# EAGLE schematic A13-SOM-LTE_Rev_B1 (EAGLE 4.16)
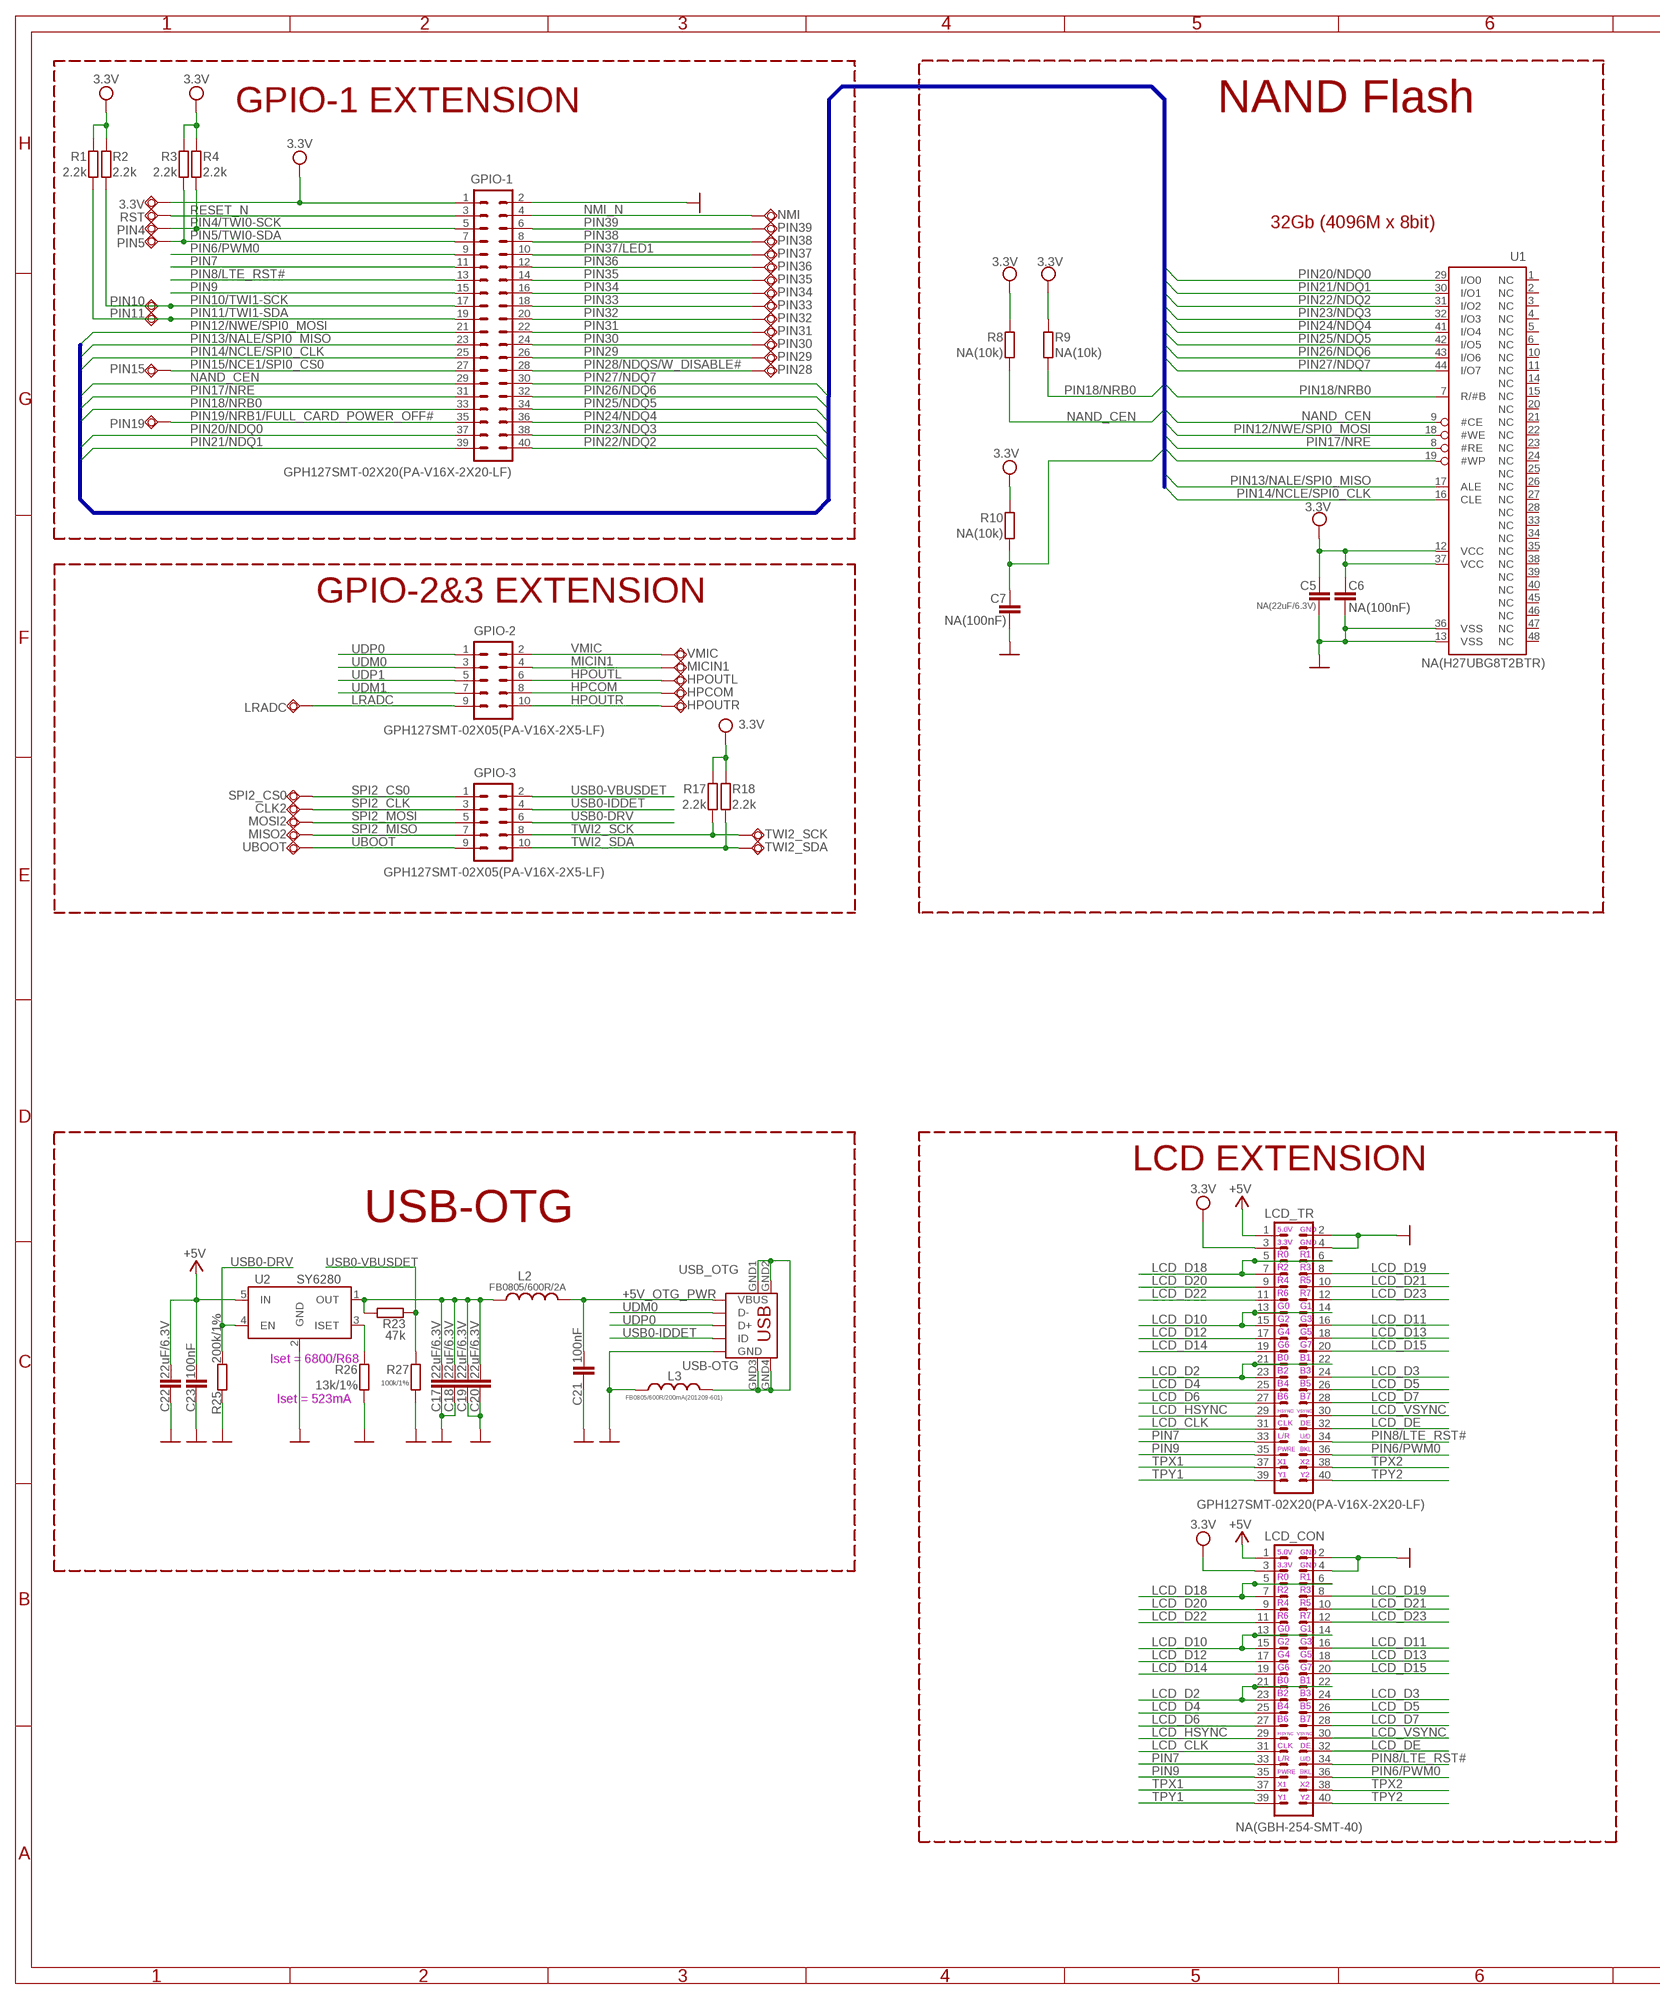
[diagram p0: schematic, sheet 1, part 1 of 2]
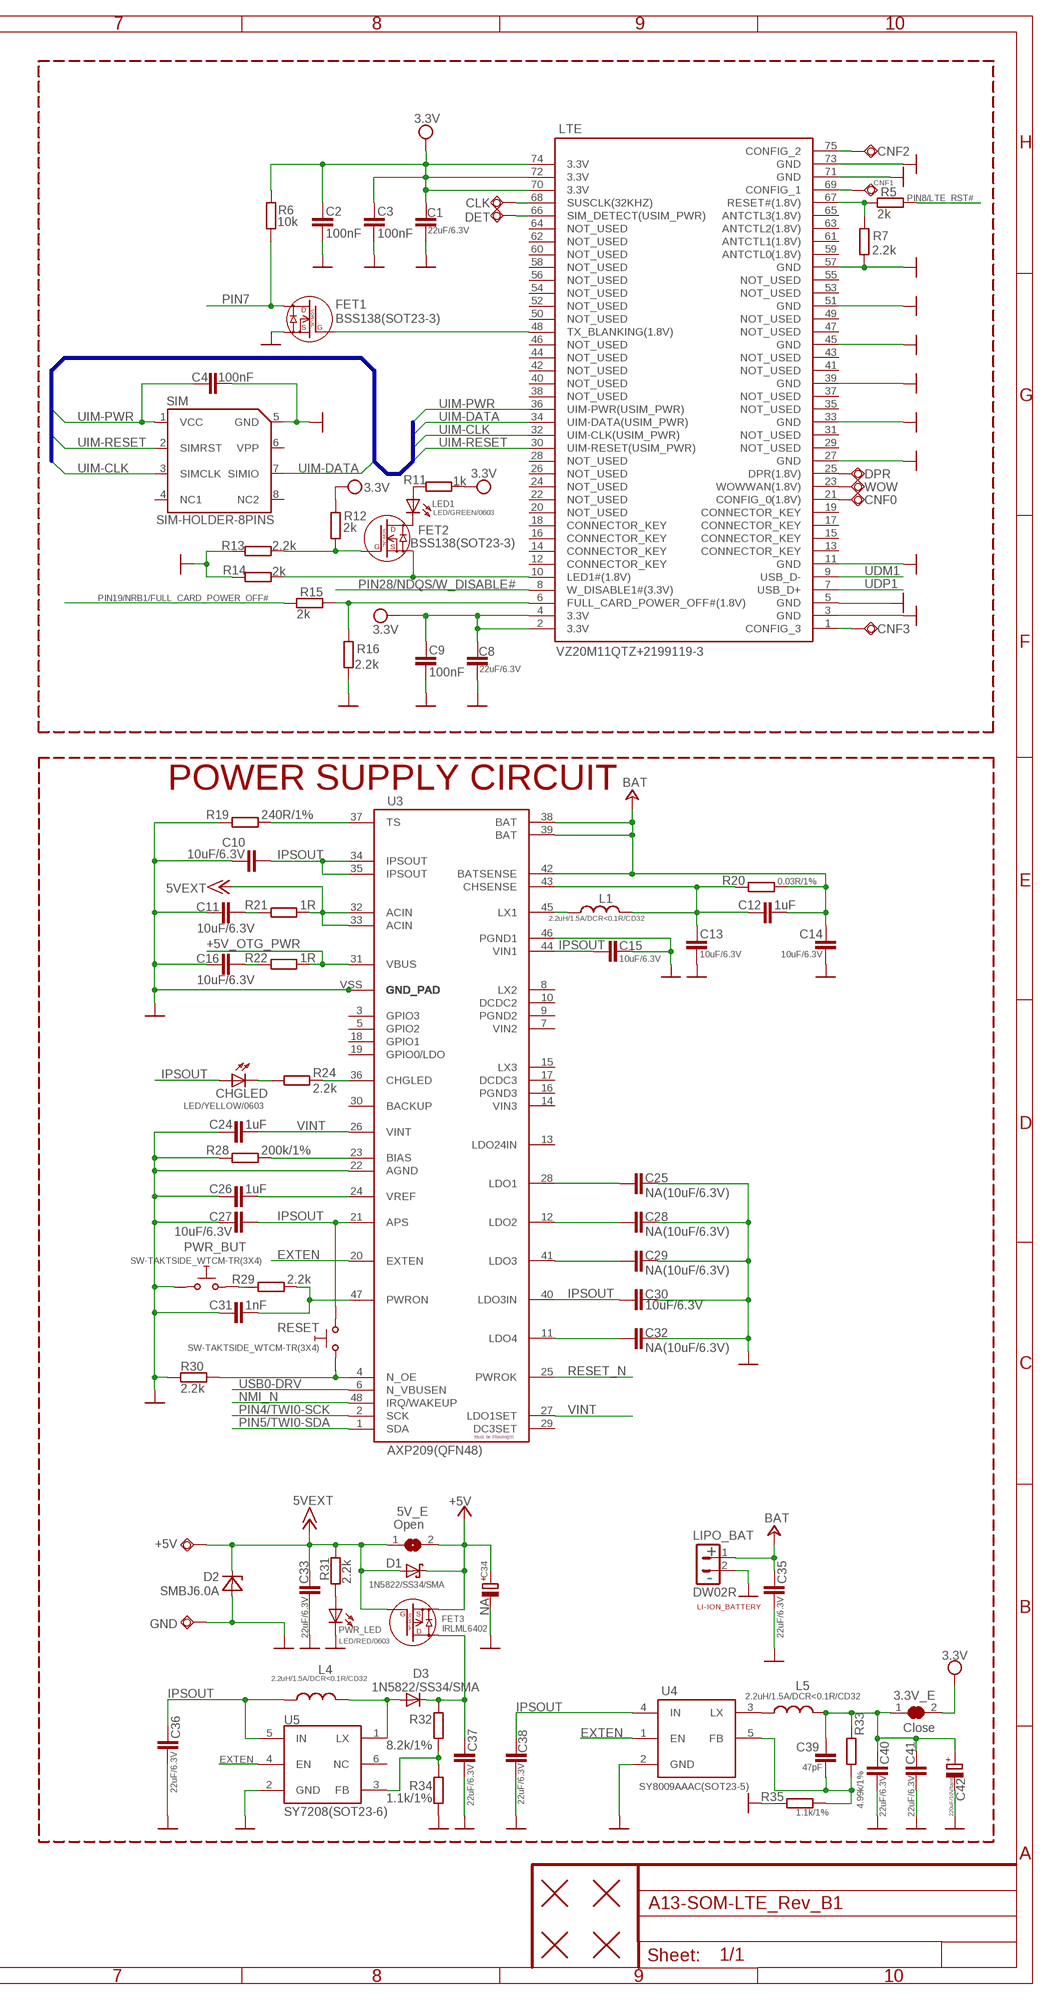
[diagram p1: schematic, sheet 1, part 2 of 2]

## Parts
3.3V  TESTPAD3  [TEST_PAD40/70/SQUARE]
3.3V_E  Close  SJSJ_1_SMALLER_CLOSE  [SJ_1_SMALLER_CLOSE]
5V_E  Open  SJSJ_SMALLER  [SJ_1_SMALLER]
+5V  TESTPAD3  [TEST_PAD40/70/SQUARE]
C1  22uF/6.3V  C-EUC0603_DWS  [C0603_DWS]
C2  100nF  C-EUC0603_DWS  [C0603_DWS]
C3  100nF  C-EUC0603_DWS  [C0603_DWS]
C4  100nF  C-EUC0603_DWS  [C0603_DWS]
C5  NA(22uF/6.3V)  C-EUC0603_DWS  [C0603_DWS]
C6  NA(100nF)  C-EUC0603_DWS  [C0603_DWS]
C7  NA(100nF)  C-EUC0603_DWS  [C0603_DWS]
C8  22uF/6.3V  C-EUC0603_DWS  [C0603_DWS]
C9  100nF  C-EUC0603_DWS  [C0603_DWS]
C10  10uF/6.3V  C-EUC0603_DWS  [C0603_DWS]
C11  10uF/6.3V  C-EUC0603_DWS  [C0603_DWS]
C12  1uF  C-EUC0603_DWS  [C0603_DWS]
C13  10uF/6.3V  C-EUC0603_DWS  [C0603_DWS]
C14  10uF/6.3V  C-EUC0603_DWS  [C0603_DWS]
C15  10uF/6.3V  C-EUC0603_DWS  [C0603_DWS]
C16  10uF/6.3V  C-EUC0603_DWS  [C0603_DWS]
C17  22uF/6.3V  C-EUC0603_DWS  [C0603_DWS]
C18  22uF/6.3V  C-EUC0603_DWS  [C0603_DWS]
C19  22uF/6.3V  C-EUC0603_DWS  [C0603_DWS]
C20  22uF/6.3V  C-EUC0603_DWS  [C0603_DWS]
C21  100nF  C-EUC0603_DWS  [C0603_DWS]
C22  22uF/6.3V  C-EUC0603_DWS  [C0603_DWS]
C23  100nF  C-EUC0603_DWS  [C0603_DWS]
C24  1uF  C-EUC0603_DWS  [C0603_DWS]
C25  NA(10uF/6.3V)  C-EUC0603_DWS  [C0603_DWS]
C26  1uF  C-EUC0603_DWS  [C0603_DWS]
C27  10uF/6.3V  C-EUC0603_DWS  [C0603_DWS]
C28  NA(10uF/6.3V)  C-EUC0603_DWS  [C0603_DWS]
C29  NA(10uF/6.3V)  C-EUC0603_DWS  [C0603_DWS]
C30  10uF/6.3V  C-EUC0603_DWS  [C0603_DWS]
C31  1nF  C-EUC0603_DWS  [C0603_DWS]
C32  NA(10uF/6.3V)  C-EUC0603_DWS  [C0603_DWS]
C33  22uF/6.3V  C-EUC0603_DWS  [C0603_DWS]
C34  NA  CPOL-EUCT7343  [CT7343]
C35  22uF/6.3V  C-EUC0603_DWS  [C0603_DWS]
C36  22uF/6.3V  C-EUC0603_DWS  [C0603_DWS]
C37  22uF/6.3V  C-EUC0603_DWS  [C0603_DWS]
C38  22uF/6.3V  C-EUC0603_DWS  [C0603_DWS]
C39  47pF  C-EUC0603_DWS  [C0603_DWS]
C40  22uF/6.3V  C-EUC0603_DWS  [C0603_DWS]
C41  22uF/6.3V  C-EUC0603_DWS  [C0603_DWS]
C42  220uF/10V/tant  CPOL-EUCT7343  [CT7343]
CHGLED  LED/YELLOW/0603  LED0603DWS  [LED-0603]
CLK  TESTPAD30/30/SQUARE  [TESTPAD_30-SQUARE]
CLK2  TESTPAD3  [TEST_PAD40/70/SQUARE]
CNF0  TESTPAD30/30/SQUARE  [TESTPAD_30-SQUARE]
CNF1  TESTPAD30/30/SQUARE  [TESTPAD_30-SQUARE]
CNF2  TESTPAD30/30/SQUARE  [TESTPAD_30-SQUARE]
CNF3  TESTPAD30/30/SQUARE  [TESTPAD_30-SQUARE]
D1  1N5822/SS34/SMA  SCHOTKKY7.62SS2  [MLL-41]
D2  SMBJ6.0A  SMBJ16A  [DO214AA]
D3  1N5822/SS34/SMA  D-MLL-41  [MELF-MLL41]
DET  TESTPAD30/30/SQUARE  [TESTPAD_30-SQUARE]
DPR  TESTPAD30/30/SQUARE  [TESTPAD_30-SQUARE]
FET1  BSS138(SOT23-3)  N-MOS+DIODBSS138(SOT23-3)  [SOT23]
FET2  BSS138(SOT23-3)  N-MOS+DIODBSS138(SOT23-3)  [SOT23]
FET3  IRLML6402  P-MOS+DIODIRLML6402  [SOT23]
FID1  FIDUCIAL  [FIDUCIAL-1X3]
FID2  FIDUCIAL  [FIDUCIAL-1X3]
FID3  FIDUCIAL  [FIDUCIAL-1X3]
FID4  FIDUCIAL  [FIDUCIAL-1X3]
GND  TESTPAD3  [TEST_PAD40/70/SQUARE]
GPIO-1  GPH127SMT-02X20(PA-V16X-2X20-LF)  ML40-GPH127SMT-02X20(PA-V16X-2X20-LF)  [GPH127SMT-02X20(PA-V16X-2X20-LF)]
GPIO-2  GPH127SMT-02X05(PA-V16X-2X5-LF)  ML10-GPH127SMT-02X05(PA-V16X-2X5-LF)  [GPH127SMT-02X05(PA-V16X-2X5-LF)]
GPIO-3  GPH127SMT-02X05(PA-V16X-2X5-LF)  ML10-GPH127SMT-02X05(PA-V16X-2X5-LF)  [GPH127SMT-02X05(PA-V16X-2X5-LF)]
HPCOM  TESTPAD3  [TEST_PAD40/70/SQUARE]
HPOUTL  TESTPAD3  [TEST_PAD40/70/SQUARE]
HPOUTR  TESTPAD3  [TEST_PAD40/70/SQUARE]
L1  2.2uH/1.5A/DCR<0.1R/CD32  L-CD32  [CD32]
L2  FB0805/600R/2A  L-USL0805_5MIL_DWS  [L0805_5MIL_DWS]
L3  FB0805/600R/200mA(201209-601)  L-USL0805_5MIL_DWS  [L0805_5MIL_DWS]
L4  2.2uH/1.5A/DCR<0.1R/CD32  L-CD32  [CD32]
L5  2.2uH/1.5A/DCR<0.1R/CD32  L-CD32  [CD32]
LCD_CON  NA(GBH-254-SMT-40)  ML40-GBH-254-SMT-40  [ML40-MALE(GBH-254-SMT-40)]
LCD_TR  GPH127SMT-02X20(PA-V16X-2X20-LF)  ML40-GPH127SMT-02X20(PA-V16X-2X20-LF)  [GPH127SMT-02X20(PA-V16X-2X20-LF)]
LED1  LED/GREEN/0603  LED0603DWS  [LED-0603]
LIPO_BAT  DW02R  CON2DW02R  [DW02R]
LRADC  TESTPAD3  [TEST_PAD40/70/SQUARE]
LTE  VZ20M11QTZ+2199119-3  M_2(NGFF)  [M_2(NGFF)]
MICIN1  TESTPAD3  [TEST_PAD40/70/SQUARE]
MISO2  TESTPAD3  [TEST_PAD40/70/SQUARE]
MOSI2  TESTPAD3  [TEST_PAD40/70/SQUARE]
NMI  TESTPAD3  [TEST_PAD40/70/SQUARE]
PIN4  TESTPAD3  [TEST_PAD40/70/SQUARE]
PIN5  TESTPAD3  [TEST_PAD40/70/SQUARE]
PIN10  TESTPAD3  [TEST_PAD40/70/SQUARE]
PIN11  TESTPAD3  [TEST_PAD40/70/SQUARE]
PIN15  TESTPAD3  [TEST_PAD40/70/SQUARE]
PIN19  TESTPAD3  [TEST_PAD40/70/SQUARE]
PIN28  TESTPAD3  [TEST_PAD40/70/SQUARE]
PIN29  TESTPAD3  [TEST_PAD40/70/SQUARE]
PIN30  TESTPAD3  [TEST_PAD40/70/SQUARE]
PIN31  TESTPAD3  [TEST_PAD40/70/SQUARE]
PIN32  TESTPAD3  [TEST_PAD40/70/SQUARE]
PIN33  TESTPAD3  [TEST_PAD40/70/SQUARE]
PIN34  TESTPAD3  [TEST_PAD40/70/SQUARE]
PIN35  TESTPAD3  [TEST_PAD40/70/SQUARE]
PIN36  TESTPAD3  [TEST_PAD40/70/SQUARE]
PIN37  TESTPAD3  [TEST_PAD40/70/SQUARE]
PIN38  TESTPAD3  [TEST_PAD40/70/SQUARE]
PIN39  TESTPAD3  [TEST_PAD40/70/SQUARE]
PWR_BUT  SW-TAKTSIDE_WTCM-TR(3X4)  [SW_TAKT3X4]
PWR_LED  LED/RED/0603  LED0603DWS  [LED-0603]
R1  2.2k  R-EU_R0603_5MIL_DWS  [R0603_5MIL_DWS]
R2  2.2k  R-EU_R0603_5MIL_DWS  [R0603_5MIL_DWS]
R3  2.2k  R-EU_R0603_5MIL_DWS  [R0603_5MIL_DWS]
R4  2.2k  R-EU_R0603_5MIL_DWS  [R0603_5MIL_DWS]
R5  2k  R-EU_R0603_5MIL_DWS  [R0603_5MIL_DWS]
R6  10k  R-EU_R0603_5MIL_DWS  [R0603_5MIL_DWS]
R7  2.2k  R-EU_R0603_5MIL_DWS  [R0603_5MIL_DWS]
R8  NA(10k)  R-EU_R0603_5MIL_DWS  [R0603_5MIL_DWS]
R9  NA(10k)  R-EU_R0603_5MIL_DWS  [R0603_5MIL_DWS]
R10  NA(10k)  R-EU_R0603_5MIL_DWS  [R0603_5MIL_DWS]
R11  1k  R-EU_R0603_5MIL_DWS  [R0603_5MIL_DWS]
R12  2k  R-EU_R0603_5MIL_DWS  [R0603_5MIL_DWS]
R13  2.2k  R-EU_R0603_5MIL_DWS  [R0603_5MIL_DWS]
R14  2k  R-EU_R0603_5MIL_DWS  [R0603_5MIL_DWS]
R15  2k  R-EU_R0603_5MIL_DWS  [R0603_5MIL_DWS]
R16  2.2k  R-EU_R0603_5MIL_DWS  [R0603_5MIL_DWS]
R17  2.2k  R-EU_R0603_5MIL_DWS  [R0603_5MIL_DWS]
R18  2.2k  R-EU_R0603_5MIL_DWS  [R0603_5MIL_DWS]
R19  240R/1%  R-EU_R0603_5MIL_DWS  [R0603_5MIL_DWS]
R20  0.03R/1%  R-EU_R1206_5MIL_WS  [R1206_5MIL_WS]
R21  1R  R-EU_R0603_5MIL_DWS  [R0603_5MIL_DWS]
R22  1R  R-EU_R0603_5MIL_DWS  [R0603_5MIL_DWS]
R23  47k  R-EU_R0603_5MIL_DWS  [R0603_5MIL_DWS]
R24  2.2k  R-EU_R0603_5MIL_DWS  [R0603_5MIL_DWS]
R25  200k/1%  R-EU_R0603_5MIL_DWS  [R0603_5MIL_DWS]
R26  13k/1%  R-EU_R0603_5MIL_DWS  [R0603_5MIL_DWS]
R27  100k/1%  R-EU_R0603_5MIL_DWS  [R0603_5MIL_DWS]
R28  200k/1%  R-EU_R0603_5MIL_DWS  [R0603_5MIL_DWS]
R29  2.2k  R-EU_R0603_5MIL_DWS  [R0603_5MIL_DWS]
R30  2.2k  R-EU_R0603_5MIL_DWS  [R0603_5MIL_DWS]
R31  2.2k  R-EU_R0603_5MIL_DWS  [R0603_5MIL_DWS]
R32  8.2k/1%  R-EU_R0603_5MIL_DWS  [R0603_5MIL_DWS]
R33  4.99k/1%  R-EU_R0603_5MIL_DWS  [R0603_5MIL_DWS]
R34  1.1k/1%  R-EU_R0603_5MIL_DWS  [R0603_5MIL_DWS]
R35  1.1k/1%  R-EU_R0603_5MIL_DWS  [R0603_5MIL_DWS]
RESET  SW-TAKTSIDE_WTCM-TR(3X4)  [SW_TAKT3X4]
RST  TESTPAD3  [TEST_PAD40/70/SQUARE]
SIM  SIM-HOLDER-8PINS  [SIM-CARD-8PIN-TRUE-PIN-NUMBERING]
SPI2_CS0  TESTPAD3  [TEST_PAD40/70/SQUARE]
TWI2_SCK  TESTPAD3  [TEST_PAD40/70/SQUARE]
TWI2_SDA  TESTPAD3  [TEST_PAD40/70/SQUARE]
U1  NA(H27UBG8T2BTR)  H27UBG8T2A  [TSOP48]
U2  SY6280  [SOT23-5]
U3  AXP209(QFN48)  AXP209  [QFN48]
U4  SY8009AAAC(SOT23-5)  SY8008  [SOT23-5]
U5  SY7208(SOT23-6)  SY7208  [SOT23-6]
UBOOT  TESTPAD3  [TEST_PAD40/70/SQUARE]
USB_OTG  USB-OTG  MINI_USB9  [USB_MINI_9PIN]
VMIC  TESTPAD3  [TEST_PAD40/70/SQUARE]
WOW  TESTPAD30/30/SQUARE  [TESTPAD_30-SQUARE]

## Nets
+5V: 5V_E.2 C22.1 C23.1 C34.+ D1.K(C) FET3.2(S) LCD_CON.1 LCD_TR.1 U2.5(IN)
+5V_OTG_PWR: C21.1 L2.1 R22.2 U3.31(VBUS) USB_OTG.VBUS
+15V: 5V_E.1 +5V.P$1(PP) C33.1 D1.A D2.C FET3.1(G) R21.2 R31.1 U3.32(ACIN) U3.33(ACIN) ; supply symbol labelled 5VEXT
+24V: C12.2 C14.1 C35.2 LIPO_BAT.1 R20.2 U3.38(BAT) U3.39(BAT) U3.42(BATSENSE) ; supply symbol labelled BAT
EXTEN: U3.20(EXTEN) U4.1(EN) U5.4(EN)
GND [PWR]: C1.2 C2.1 C3.1 C4.2 C5.1 C6.1 C7.1 C8.2 C9.1 C10.1 C11.1 C13.2 C14.2 C15.2 C16.1 C17.2 C18.2 C19.2 C20.2 C21.2 C22.2 C23.2 C24.1 C25.2 C26.1 C27.1 C28.2 C29.2 C30.2 C31.1 C32.2 C33.2 C34.- C35.1 C36.1 C37.2 C38.2 C40.2 C41.2 C42.- D2.A FET1.2(S) GND.P$1(PP) GPIO-1.2 L3.1 LCD_CON.2 LCD_CON.4 LCD_TR.2 LCD_TR.4 LIPO_BAT.2 LTE.3(GND) LTE.5(GND) LTE.11(GND) LTE.27(GND) LTE.33(GND) LTE.39(GND) LTE.45(GND) LTE.51(GND) LTE.57(GND) LTE.71(GND) LTE.73(GND) PWR_BUT.2_1 PWR_LED.C R7.2 R13.2 R14.2 R16.2 R19.1 R25.1 R26.1 R27.1 R28.1 R30.1 R34.2 R35.2 SIM.5(GND) U1.13(VSS) U1.36(VSS) U2.2(GND) U3.22(AGND) U3.46(PGND1) U3.N1(GND_PAD) U3.N2(GND_PAD) U3.N3(GND_PAD) U3.N4(GND_PAD) U3.N5(GND_PAD) U3.N6(GND_PAD) U3.N7(GND_PAD) U3.N8(GND_PAD) U3.N9(GND_PAD) U3.N10(GND_PAD) U3.N11(GND_PAD) U3.N12(GND_PAD) U3.N13(GND_PAD) U3.N14(GND_PAD) U3.N15(GND_PAD) U3.N16(GND_PAD) U3.N17(GND_PAD) U3.VSS(GND_PAD) U4.2(GND) U5.2(GND) USB_OTG.GND
HPCOM: GPIO-2.8 HPCOM.P$1(PP)
HPOUTL: GPIO-2.6 HPOUTL.P$1(PP)
HPOUTR: GPIO-2.10 HPOUTR.P$1(PP)
IPSOUT: C10.2 C15.1 C27.2 C30.1 C36.2 C38.1 CHGLED.A L4.1 RESET.1_1 U3.21(APS) U3.34(IPSOUT) U3.35(IPSOUT) U3.40(LDO3IN) U3.44(VIN1) U4.4(IN) U5.5(IN)
LCD_CLK: LCD_CON.31 LCD_TR.31
LCD_D2: LCD_CON.21 LCD_CON.22 LCD_CON.23 LCD_TR.21 LCD_TR.22 LCD_TR.23
LCD_D3: LCD_CON.24 LCD_TR.24
LCD_D4: LCD_CON.25 LCD_TR.25
LCD_D5: LCD_CON.26 LCD_TR.26
LCD_D6: LCD_CON.27 LCD_TR.27
LCD_D7: LCD_CON.28 LCD_TR.28
LCD_D10: LCD_CON.13 LCD_CON.14 LCD_CON.15 LCD_TR.13 LCD_TR.14 LCD_TR.15
LCD_D11: LCD_CON.16 LCD_TR.16
LCD_D12: LCD_CON.17 LCD_TR.17
LCD_D13: LCD_CON.18 LCD_TR.18
LCD_D14: LCD_CON.19 LCD_TR.19
LCD_D15: LCD_CON.20 LCD_TR.20
LCD_D18: LCD_CON.5 LCD_CON.6 LCD_CON.7 LCD_TR.5 LCD_TR.6 LCD_TR.7
LCD_D19: LCD_CON.8 LCD_TR.8
LCD_D20: LCD_CON.9 LCD_TR.9
LCD_D21: LCD_CON.10 LCD_TR.10
LCD_D22: LCD_CON.11 LCD_TR.11
LCD_D23: LCD_CON.12 LCD_TR.12
LCD_DE: LCD_CON.32 LCD_TR.32
LCD_HSYNC: LCD_CON.29 LCD_TR.29
LCD_VSYNC: LCD_CON.30 LCD_TR.30
LRADC: GPIO-2.9 LRADC.P$1(PP)
MICIN1: GPIO-2.4 MICIN1.P$1(PP)
N$1: C28.1 U3.12(LDO2)
N$2: LTE.6(FULL_CARD_POWER_OFF#(1.8V)) R15.1 R16.1
N$3: LTE.67(RESET#(1.8V)) R5.2 R7.1
N$4: FET1.1(G) LTE.48(TX_BLANKING(1.8V))
N$5: FET2.2(S) LTE.10(LED1#(1.8V)) R14.1
N$6: FET2.3(D) LED1.C
N$7: FET2.1(G) R12.2 R13.1
N$8: LED1.A R11.2
N$9: C25.1 U3.28(LDO1)
N$10: CLK.1(PP) LTE.68(SUSCLK(32KHZ))
N$11: DET.1(PP) LTE.66(SIM_DETECT(USIM_PWR))
N$12: CNF3.1(PP) LTE.1(CONFIG_3)
N$13: CNF1.1(PP) LTE.69(CONFIG_1)
N$14: CNF2.1(PP) LTE.75(CONFIG_2)
N$15: DPR.1(PP) LTE.25(DPR(1.8V))
N$16: C17.1 C18.1 C19.1 C20.1 L2.2 R23.2 U2.1(OUT)
N$17: LTE.23(WOWWAN(1.8V)) WOW.1(PP)
N$18: CNF0.1(PP) LTE.21(CONFIG_0(1.8V))
N$19: C32.1 U3.11(LDO4)
N$22: C29.1 U3.41(LDO3)
N$27: PWR_LED.A R31.2
N$28: D3.2(A) L4.2 U5.1(LX)
N$29: R32.1 R34.1 U5.3(FB)
N$34: R24.2 U3.36(CHGLED)
N$35: C37.1 D3.1(C) FET3.3(D) R32.2
N$38: PWR_BUT.1_1 R29.1
N$43: CHGLED.C R24.1
N$64: L5.1 U4.3(LX)
N$65: 3.3V_E.1 C39.1 C40.1 C41.1 C42.+ L5.2 R33.1
N$66: C39.2 R33.2 R35.1 U4.5(FB)
N$99: R26.2 U2.3(ISET)
N$120: R28.2 U3.23(BIAS)
N$124: C7.2 R10.2 U1.19(#WP)
N$125: R19.2 U3.37(TS)
N$127: L1.1 U3.45(LX1)
N$128: C12.1 C13.1 L1.2 R20.1 U3.43(CHSENSE)
N$132: C26.2 U3.24(VREF)
N$134: C11.2 R21.1
N$135: C16.2 R22.1
N$139: C31.2 R29.2 U3.47(PWRON)
N$140: R30.2 RESET.2_1 U3.4(N_OE)
N$266: L3.2 USB_OTG.GND1 USB_OTG.GND2 USB_OTG.GND3 USB_OTG.GND4
NAND_CEN: GPIO-1.29 R8.2 U1.9(#CE)
NMI_N: GPIO-1.4 NMI.P$1(PP) U3.48(IRQ/WAKEUP)
PIN4/TWI0-SCK: GPIO-1.5 PIN4.P$1(PP) R4.1 U3.2(SCK)
PIN5/TWI0-SDA: GPIO-1.7 PIN5.P$1(PP) R3.1 U3.1(SDA)
PIN6/PWM0: GPIO-1.9 LCD_CON.36 LCD_TR.36
PIN7: FET1.3(D) GPIO-1.11 LCD_CON.33 LCD_TR.33 R6.2
PIN8/LTE_RST#: GPIO-1.13 LCD_CON.34 LCD_TR.34 R5.1
PIN9: GPIO-1.15 LCD_CON.35 LCD_TR.35
PIN10/TWI1-SCK: GPIO-1.17 PIN10.P$1(PP) R2.1
PIN11/TWI1-SDA: GPIO-1.19 PIN11.P$1(PP) R1.1
PIN12/NWE/SPI0_MOSI: GPIO-1.21 U1.18(#WE)
PIN13/NALE/SPI0_MISO: GPIO-1.23 U1.17(ALE)
PIN14/NCLE/SPI0_CLK: GPIO-1.25 U1.16(CLE)
PIN15/NCE1/SPI0_CS0: GPIO-1.27 PIN15.P$1(PP)
PIN17/NRE: GPIO-1.31 U1.8(#RE)
PIN18/NRB0: GPIO-1.33 R9.2 U1.7(R/#B)
PIN19/NRB1/FULL_CARD_POWER_OFF#: GPIO-1.35 PIN19.P$1(PP) R15.2
PIN20/NDQ0: GPIO-1.37 U1.29(I/O0)
PIN21/NDQ1: GPIO-1.39 U1.30(I/O1)
PIN22/NDQ2: GPIO-1.40 U1.31(I/O2)
PIN23/NDQ3: GPIO-1.38 U1.32(I/O3)
PIN24/NDQ4: GPIO-1.36 U1.41(I/O4)
PIN25/NDQ5: GPIO-1.34 U1.42(I/O5)
PIN26/NDQ6: GPIO-1.32 U1.43(I/O6)
PIN27/NDQ7: GPIO-1.30 U1.44(I/O7)
PIN28/NDQS/W_DISABLE#: GPIO-1.28 LTE.8(W_DISABLE1#(3.3V)) PIN28.P$1(PP)
PIN29: GPIO-1.26 PIN29.P$1(PP)
PIN30: GPIO-1.24 PIN30.P$1(PP)
PIN31: GPIO-1.22 PIN31.P$1(PP)
PIN32: GPIO-1.20 PIN32.P$1(PP)
PIN33: GPIO-1.18 PIN33.P$1(PP)
PIN34: GPIO-1.16 PIN34.P$1(PP)
PIN35: GPIO-1.14 PIN35.P$1(PP)
PIN36: GPIO-1.12 PIN36.P$1(PP)
PIN37/LED1 [PWR]: GPIO-1.10 PIN37.P$1(PP)
PIN38: GPIO-1.8 PIN38.P$1(PP)
PIN39 [PWR]: GPIO-1.6 PIN39.P$1(PP)
RESET_N: GPIO-1.3 RST.P$1(PP) U3.25(PWROK)
SPI2_CLK: CLK2.P$1(PP) GPIO-3.3
SPI2_CS0: GPIO-3.1 SPI2_CS0.P$1(PP)
SPI2_MISO: GPIO-3.7 MISO2.P$1(PP)
SPI2_MOSI: GPIO-3.5 MOSI2.P$1(PP)
TPX1: LCD_CON.37 LCD_TR.37
TPX2: LCD_CON.38 LCD_TR.38
TPY1: LCD_CON.39 LCD_TR.39
TPY2: LCD_CON.40 LCD_TR.40
TWI2_SCK: GPIO-3.8 R17.1 TWI2_SCK.P$1(PP)
TWI2_SDA: GPIO-3.10 R18.1 TWI2_SDA.P$1(PP)
UBOOT: GPIO-3.9 UBOOT.P$1(PP)
UDM0: GPIO-2.3 USB_OTG.D-
UDM1: GPIO-2.7 LTE.9(USB_D-)
UDP0: GPIO-2.1 USB_OTG.D+
UDP1: GPIO-2.5 LTE.7(USB_D+)
UIM-CLK: LTE.32(UIM-CLK(USIM_PWR)) SIM.3(SIMCLK)
UIM-DATA: LTE.34(UIM-DATA(USIM_PWR)) SIM.7(SIMIO)
UIM-PWR: C4.1 LTE.36(UIM-PWR(USIM_PWR)) SIM.1(VCC)
UIM-RESET: LTE.30(UIM-RESET(USIM_PWR)) SIM.2(SIMRST)
USB0-DRV: GPIO-3.6 R25.2 U2.4(EN) U3.6(N_VBUSEN)
USB0-IDDET: GPIO-3.4 USB_OTG.ID
USB0-VBUSDET: GPIO-3.2 R23.1 R27.2
VCC [PWR]: 3.3V.P$1(PP) 3.3V_E.2 C1.1 C2.2 C3.2 C5.2 C6.2 C8.1 C9.2 GPIO-1.1 LCD_CON.3 LCD_TR.3 LTE.2(3.3V) LTE.4(3.3V) LTE.70(3.3V) LTE.72(3.3V) LTE.74(3.3V) R1.2 R2.2 R3.2 R4.2 R6.1 R8.1 R9.1 R10.1 R11.1 R12.1 R17.2 R18.2 U1.12(VCC) U1.37(VCC) ; supply symbol labelled 3.3V
VINT: C24.2 U3.26(VINT) U3.27(LDO1SET)
VMIC: GPIO-2.2 VMIC.P$1(PP)
Unconnected: LTE.12(CONNECTOR_KEY) LTE.13(CONNECTOR_KEY) LTE.14(CONNECTOR_KEY) LTE.15(CONNECTOR_KEY) LTE.16(CONNECTOR_KEY) LTE.17(CONNECTOR_KEY) LTE.18(CONNECTOR_KEY) LTE.19(CONNECTOR_KEY) LTE.20(NOT_USED) LTE.22(NOT_USED) LTE.24(NOT_USED) LTE.26(NOT_USED) LTE.28(NOT_USED) LTE.29(NOT_USED) LTE.31(NOT_USED) LTE.35(NOT_USED) LTE.37(NOT_USED) LTE.38(NOT_USED) LTE.40(NOT_USED) LTE.41(NOT_USED) LTE.42(NOT_USED) LTE.43(NOT_USED) LTE.44(NOT_USED) LTE.46(NOT_USED) LTE.47(NOT_USED) LTE.49(NOT_USED) LTE.50(NOT_USED) LTE.52(NOT_USED) LTE.53(NOT_USED) LTE.54(NOT_USED) LTE.55(NOT_USED) LTE.56(NOT_USED) LTE.58(NOT_USED) LTE.59(ANTCTL0(1.8V)) LTE.60(NOT_USED) LTE.61(ANTCTL1(1.8V)) LTE.62(NOT_USED) LTE.63(ANTCTL2(1.8V)) LTE.64(NOT_USED) LTE.65(ANTCTL3(1.8V)) SIM.4(NC1) SIM.6(VPP) SIM.8(NC2) U1.1(NC) U1.2(NC) U1.3(NC) U1.4(NC) U1.5(NC) U1.6(NC) U1.10(NC) U1.11(NC) U1.14(NC) U1.15(NC) U1.20(NC) U1.21(NC) U1.22(NC) U1.23(NC) U1.24(NC) U1.25(NC) U1.26(NC) U1.27(NC) U1.28(NC) U1.33(NC) U1.34(NC) U1.35(NC) U1.38(NC) U1.39(NC) U1.40(NC) U1.45(NC) U1.46(NC) U1.47(NC) U1.48(NC) U3.3(GPIO3) U3.5(GPIO2) U3.8(LX2) U3.10(DCDC2) U3.15(LX3) U3.17(DCDC3) U3.18(GPIO1) U3.19(GPIO0/LDO) U3.29(DC3SET) U3.30(BACKUP) U5.6(NC)

## Buses
NDQ[0..7],NWE,NALE,NCLE,NCE0,NCE1,NRE,NRB[0..1],NDQS
UIM-PWR,UIM-DATA,UIM-CLK,UIM-RESET

## Notes on the sheet
- GPIO-1 EXTENSION | NAND Flash
- 32Gb (4096M x 8bit)
- GPIO-2&3 EXTENSION
- POWER SUPPLY CIRCUIT
- LCD EXTENSION
- USB-OTG
- 5.0V | GND
- 3.3V | GND
- R0 | R1
- R2 | R3
- R4 | R5
- R6 | R7
- G0 | G1
- G2 | G3
- G4 | G5
- G6 | G7
- Iset = 6800/R68 | B0 | B1
- B2 | B3
- B4 | B5
- B6 | B7
- Iset = 523mA
- HSYNC | VSYNC
- CLK | DE
- L/R | U/D | Must be Floating!!!
- PWRE | BKL
- X1 | X2
- Y1 | Y2
- 5.0V | GND
- +
- 3.3V | GND
- -
- R0 | R1
- R2 | R3
- R4 | R5
- LI-ION_BATTERY
- R6 | R7
- G0 | G1
- G2 | G3
- G4 | G5
- G6 | G7
- B0 | B1
- B2 | B3
- B4 | B5
- B6 | B7
- HSYNC | VSYNC
- CLK | DE
- L/R | U/D
- PWRE | BKL
- X1 | X2
- Y1 | Y2

## Power pins joined to a net without a drawn wire
LDO24IN: U3.13(LDO24IN)
PGND2: U3.9(PGND2)
PGND3: U3.16(PGND3)
VIN2: U3.7(VIN2)
VIN3: U3.14(VIN3)

## Library data of the parts
3.3V +5V CLK CLK2 CNF0 CNF1-CNF3 DET DPR GND HPCOM HPOUTL HPOUTR LRADC MICIN1 MISO2 MOSI2 NMI PIN4 PIN5 PIN10 PIN11 PIN15 PIN19 PIN28-PIN39 RST SPI2_CS0 TWI2_SCK TWI2_SDA UBOOT VMIC WOW = gogo:TESTPAD: drill 40mils, diameter 70mils
3.3V_E 5V_E = jumper:SJ: SMD solder JUMPER
C1-C33 C35-C41 = rcl:C-EU: CAPACITOR, European symbol
C34 C42 = rcl:CPOL-EU: POLARIZED CAPACITOR, European symbol
CHGLED LED1 PWR_LED = DOUBLE-SIDE:LED
D1 = gogo:SCHOTKKY7.62SS
D2 = OLIMEX_DISCRET:SMBJ16A
D3 = semicon-smd-ipc:D-: DIODE unfilled
FET1 FET2 = Penko:N-MOS+DIOD
FET3 = Penko:P-MOS+DIOD
FID1-FID4 = SparkFunEagle-6-6-07:FIDUCIAL: Fiducial Alignment Points Various fiducial points for machine vision alignment.
GPIO-1 LCD_CON LCD_TR = con-harting-ml:ML40: HARTING
GPIO-2 GPIO-3 = con-harting-ml:ML10: HARTING
L1 L4 L5 = OLIMEX_DISCRET:L
L2 L3 = rcl:L-US: INDUCTOR, American symbol
LIPO_BAT = Penko:CON2
LTE = OLIMEX_CONNECTORS:M_2(NGFF): M.2 WWAN socket 2, type 3042-S3-B
PWR_BUT RESET = gogo:SW-TAKT
R1-R35 = rcl:R-EU_: RESISTOR, European symbol
SIM = OLIMEX_CONNECTORS:SIM-HOLDER-8PINS
U1 = OLIMEX_IC:H27UBG8T2A
U2 = OLIMEX_IC:SY6280
U3 = OLIMEX_IC:AXP209
U4 = OLIMEX_IC:SY8008
U5 = OLIMEX_IC:SY7208
USB_OTG = OLIMEX_CONNECTORS:MINI_USB9